# EAGLE design Power (EAGLE 8.3.2)
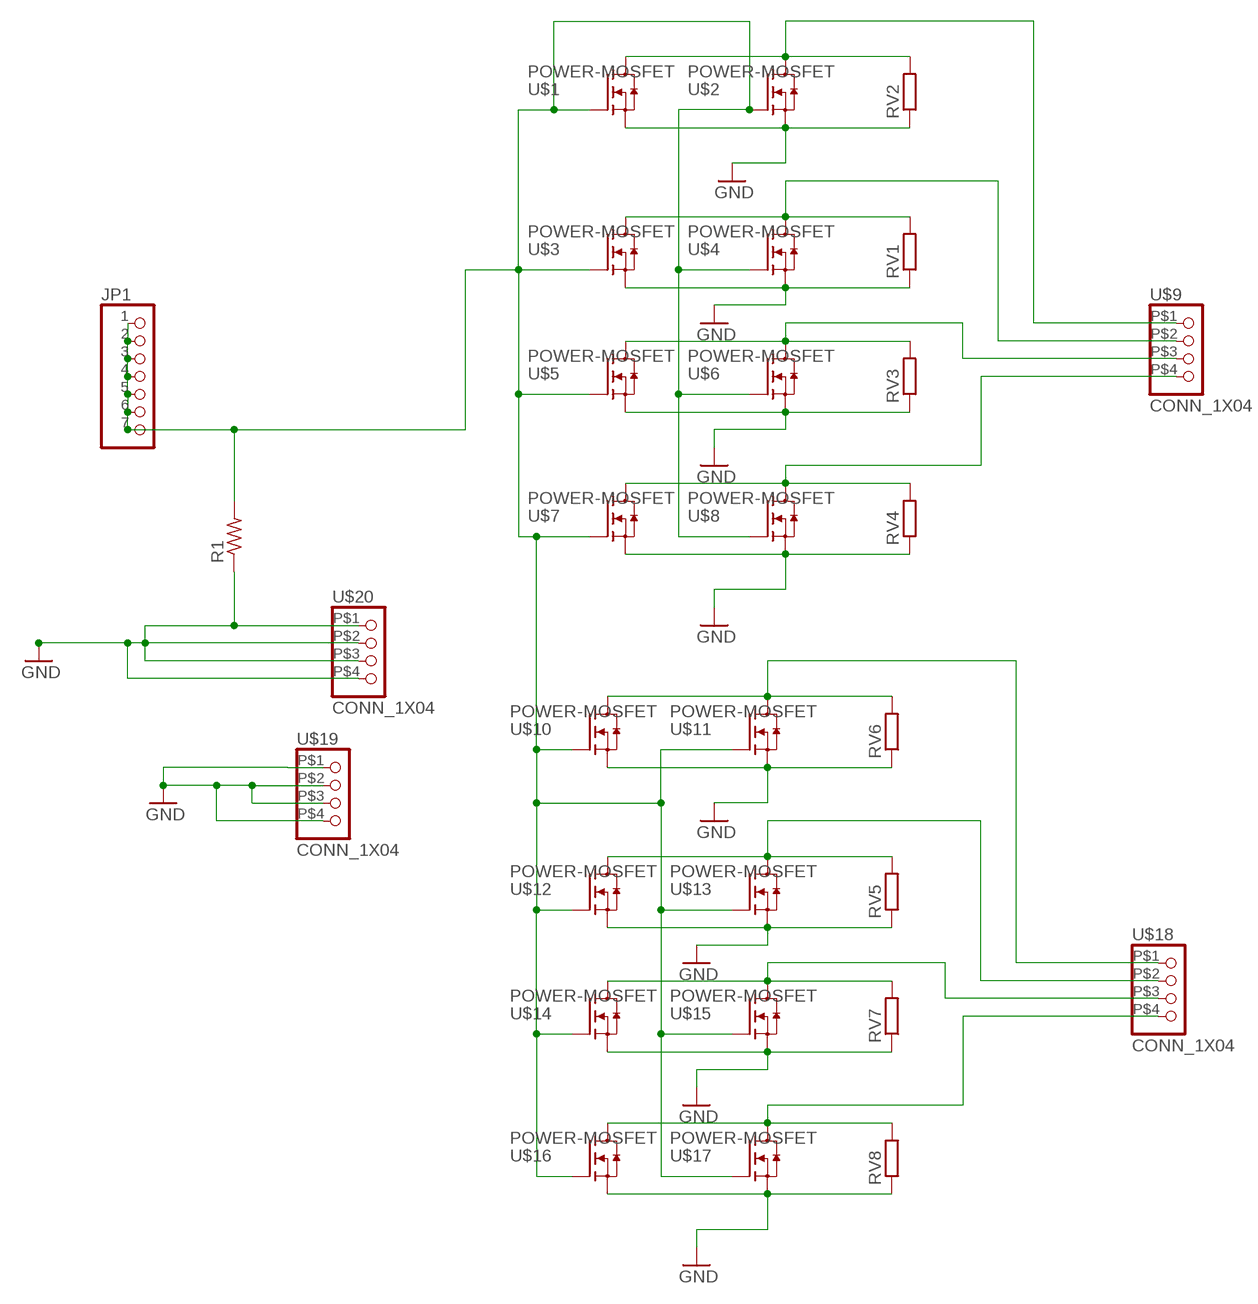
[diagram p0: schematic, sheet 1]

## Parts
JP1  PINHD-1X7  [1X07]
R1  R-US_R0603  [R0603]
RV1  R-EU_R1210  [R1210]
RV2  R-EU_R1210  [R1210]
RV3  R-EU_R1210  [R1210]
RV4  R-EU_R1210  [R1210]
RV5  R-EU_R1210  [R1210]
RV6  R-EU_R1210  [R1210]
RV7  R-EU_R1210  [R1210]
RV8  R-EU_R1210  [R1210]
U$1  POWER-MOSFET  [BSC010N04LS]
U$2  POWER-MOSFET  [BSC010N04LS]
U$3  POWER-MOSFET  [BSC010N04LS]
U$4  POWER-MOSFET  [BSC010N04LS]
U$5  POWER-MOSFET  [BSC010N04LS]
U$6  POWER-MOSFET  [BSC010N04LS]
U$7  POWER-MOSFET  [BSC010N04LS]
U$8  POWER-MOSFET  [BSC010N04LS]
U$9  CONN_1X04  [CONN_1X04]
U$10  POWER-MOSFET  [BSC010N04LS]
U$11  POWER-MOSFET  [BSC010N04LS]
U$12  POWER-MOSFET  [BSC010N04LS]
U$13  POWER-MOSFET  [BSC010N04LS]
U$14  POWER-MOSFET  [BSC010N04LS]
U$15  POWER-MOSFET  [BSC010N04LS]
U$16  POWER-MOSFET  [BSC010N04LS]
U$17  POWER-MOSFET  [BSC010N04LS]
U$18  CONN_1X04  [CONN_1X04]
U$19  CONN_1X04  [CONN_1X04]
U$20  CONN_1X04  [CONN_1X04]

## Nets
GND: R1.1 RV1.1 RV2.1 RV3.1 RV4.1 RV5.1 RV6.1 RV7.1 RV8.1 U$1.P$3(S) U$1.S U$2.P$3(S) U$2.S U$3.P$3(S) U$3.S U$4.P$3(S) U$4.S U$5.P$3(S) U$5.S U$6.P$3(S) U$6.S U$7.P$3(S) U$7.S U$8.P$3(S) U$8.S U$10.P$3(S) U$10.S U$11.P$3(S) U$11.S U$12.P$3(S) U$12.S U$13.P$3(S) U$13.S U$14.P$3(S) U$14.S U$15.P$3(S) U$15.S U$16.P$3(S) U$16.S U$17.P$3(S) U$17.S U$19.P$1 U$19.P$2 U$19.P$3 U$19.P$4 U$20.P$1 U$20.P$2 U$20.P$3 U$20.P$4
N$1: RV2.2 U$1.D U$1.P$1(D) U$1.P$2(D) U$1.P$4(D) U$1.P$5(D) U$1.P$6(D) U$1.P$7(D) U$2.D U$2.P$1(D) U$2.P$2(D) U$2.P$4(D) U$2.P$5(D) U$2.P$6(D) U$2.P$7(D) U$9.P$1
N$2: RV6.2 U$10.D U$10.P$1(D) U$10.P$2(D) U$10.P$4(D) U$10.P$5(D) U$10.P$6(D) U$10.P$7(D) U$11.D U$11.P$1(D) U$11.P$2(D) U$11.P$4(D) U$11.P$5(D) U$11.P$6(D) U$11.P$7(D) U$18.P$1
N$3: RV5.2 U$12.D U$12.P$1(D) U$12.P$2(D) U$12.P$4(D) U$12.P$5(D) U$12.P$6(D) U$12.P$7(D) U$13.D U$13.P$1(D) U$13.P$2(D) U$13.P$4(D) U$13.P$5(D) U$13.P$6(D) U$13.P$7(D) U$18.P$2
N$4: RV7.2 U$14.D U$14.P$1(D) U$14.P$2(D) U$14.P$4(D) U$14.P$5(D) U$14.P$6(D) U$14.P$7(D) U$15.D U$15.P$1(D) U$15.P$2(D) U$15.P$4(D) U$15.P$5(D) U$15.P$6(D) U$15.P$7(D) U$18.P$3
N$5: RV1.2 U$3.D U$3.P$1(D) U$3.P$2(D) U$3.P$4(D) U$3.P$5(D) U$3.P$6(D) U$3.P$7(D) U$4.D U$4.P$1(D) U$4.P$2(D) U$4.P$4(D) U$4.P$5(D) U$4.P$6(D) U$4.P$7(D) U$9.P$2
N$6: RV3.2 U$5.D U$5.P$1(D) U$5.P$2(D) U$5.P$4(D) U$5.P$5(D) U$5.P$6(D) U$5.P$7(D) U$6.D U$6.P$1(D) U$6.P$2(D) U$6.P$4(D) U$6.P$5(D) U$6.P$6(D) U$6.P$7(D) U$9.P$3
N$7: RV8.2 U$16.D U$16.P$1(D) U$16.P$2(D) U$16.P$4(D) U$16.P$5(D) U$16.P$6(D) U$16.P$7(D) U$17.D U$17.P$1(D) U$17.P$2(D) U$17.P$4(D) U$17.P$5(D) U$17.P$6(D) U$17.P$7(D) U$18.P$4
N$8: RV4.2 U$7.D U$7.P$1(D) U$7.P$2(D) U$7.P$4(D) U$7.P$5(D) U$7.P$6(D) U$7.P$7(D) U$8.D U$8.P$1(D) U$8.P$2(D) U$8.P$4(D) U$8.P$5(D) U$8.P$6(D) U$8.P$7(D) U$9.P$4
N$9: JP1.1 JP1.2 JP1.3 JP1.4 JP1.5 JP1.6 JP1.7 R1.2 U$1.G U$2.G U$3.G U$4.G U$5.G U$6.G U$7.G U$8.G U$10.G U$11.G U$12.G U$13.G U$14.G U$15.G U$16.G U$17.G

## Library data of the parts
JP1 = pinhead:PINHD-1X7: PIN HEADER
R1 = resistor:R-US_: RESISTOR, American symbol
RV1-RV8 = resistor:R-EU_: RESISTOR, European symbol
U$1-U$8 U$10-U$17 = Power-MOSFET:POWER-MOSFET
U$9 U$18-U$20 = Motor_Connector:CONN_1X04

## Board
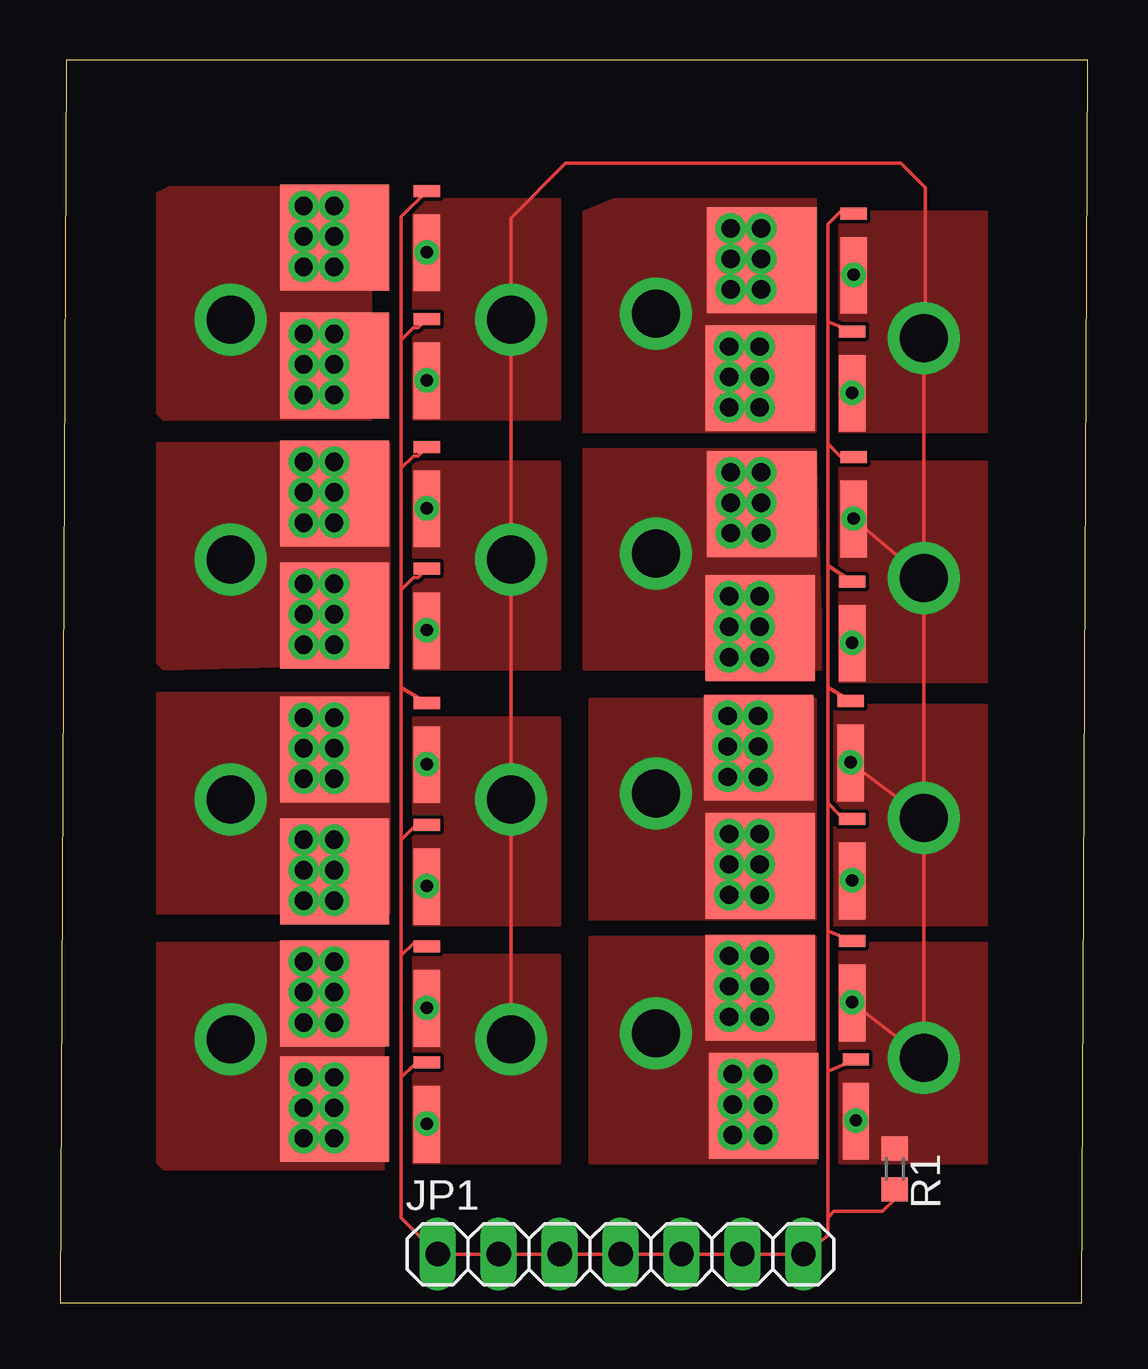
[diagram p1: board, top side]
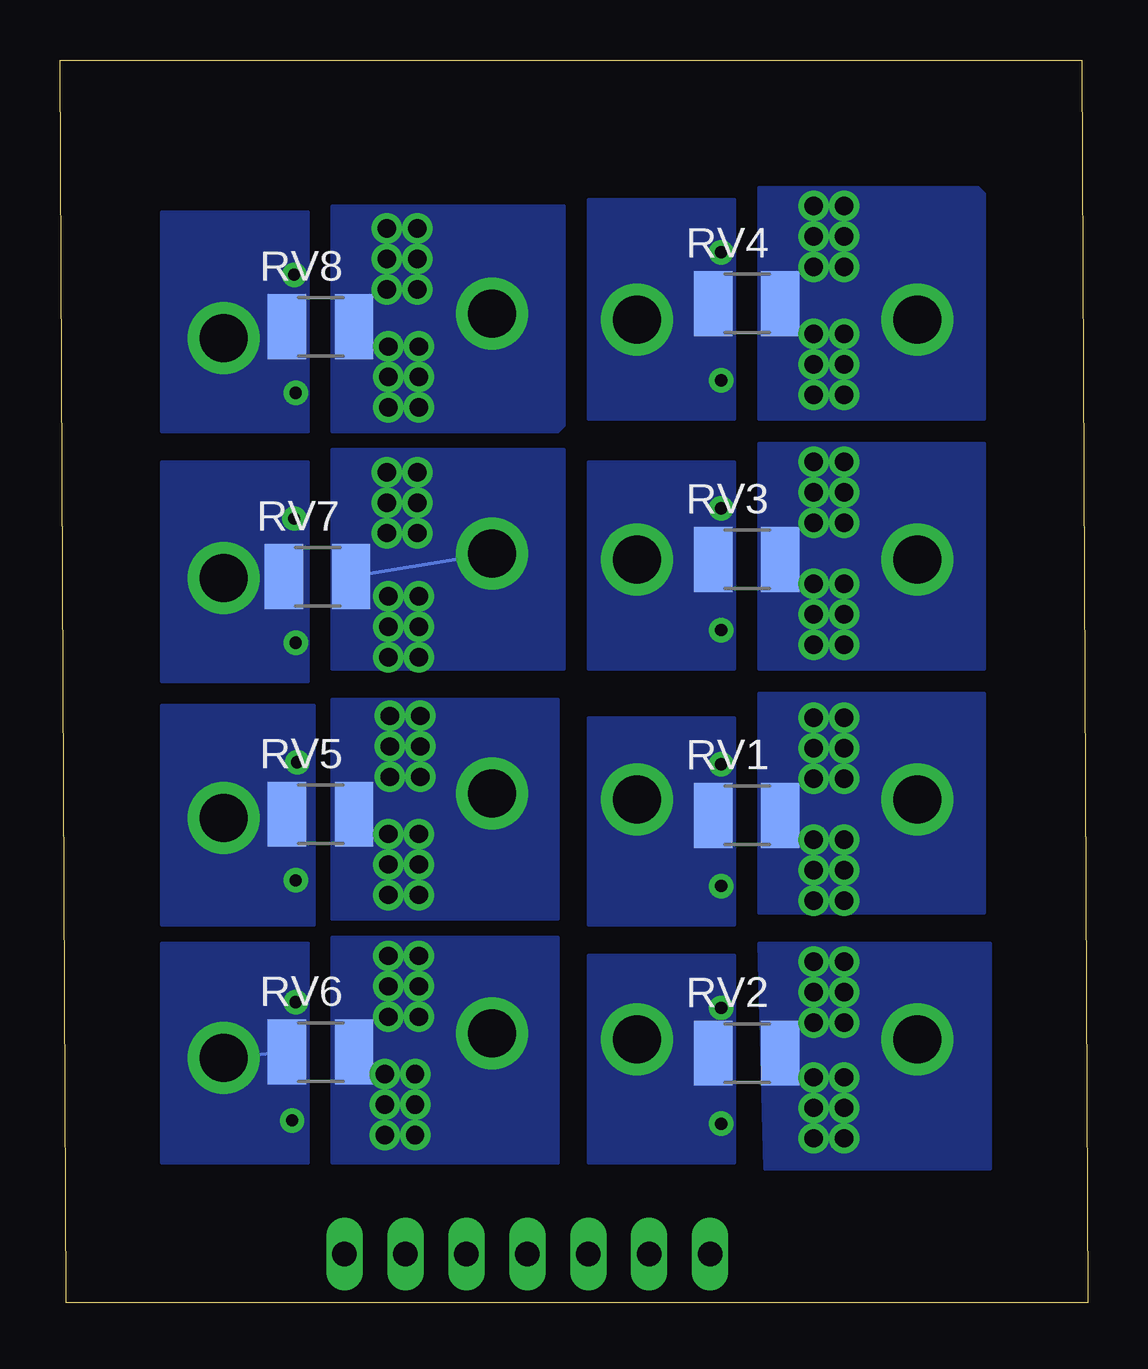
[diagram p2: board, bottom side, seen from below]

Size 42.85 x 51.81 mm. Coordinates in mm from the lower left corner, seen from the top.
Outline: 0,0 42.6,0 42.85,51.81 0.25,51.81 0,0
Copper layers (1*16): Top 0.035mm / dielectric 1.5mm / Bottom 0.035mm
Design rules "default *": minimum track width 6mil, minimum drill 0.35mm, track to track 6mil, track to pad 6mil, pad to pad 6mil, via to via 6mil, smd to smd 6mil, copper to edge 40mil, drill to drill 6mil, minimum pad ring 10mil, minimum via ring 8mil, stop-mask expansion 4mil, vias tented up to drill 30mil, thermal gap 10mil

### Footprints (pad centres in the part's own frame; a part is rotated, then mirrored left to right if it is on the bottom)
1X07 = drill 1.016 long: 1 -7.62,0; 2 -5.08,0; 3 -2.54,0; 4 0,0; 5 2.54,0; 6 5.08,0; 7 7.62,0
R0603 = smd 1 x 1.1: 1 -0.85,0; 2 0.85,0
R1210 = smd 1.6 x 2.7: 1 -1.4,0; 2 1.4,0
BSC010N04LS = smd 4.41 x 4.55: D 0.2,3.28 | smd 0.5 x 1.1: G 2.15,-0.56 | drill 0.762: P$1 1.524,4.572; P$2 -1.016,3.302; P$4 0.254,4.572; P$5 -1.016,4.572; P$6 0.254,3.302; P$7 1.524,3.302 | drill 0.508: P$3 -0.406,-0.559 | smd 3.2 x 1.1: S -0.43,-0.56
CONN_1X04 = drill 2 pad 2.5: P$1 -20,0; P$2 -10,0; P$3 0,0; P$4 10,0

### Placement (x,y rotation side)
JP1  23.37,2.03 0 top
R1  34.8,5.59 270 top
RV1  14.22,20.32 0 bottom
RV2  14.22,10.41 0 bottom
RV3  14.22,30.99 0 bottom
RV4  14.22,41.66 0 bottom
RV5  31.99,20.37 0 bottom
RV6  31.99,10.46 0 bottom
RV7  32.12,30.27 0 bottom
RV8  31.99,40.69 0 bottom
U$1  14.73,12.7 90 top
U$2  14.73,7.87 90 top
U$3  14.73,22.86 90 top
U$4  14.73,17.78 90 top
U$5  14.73,28.45 90 top
U$6  14.73,33.53 90 top
U$7  14.73,38.86 90 top
U$8  14.73,44.2 90 top
U$9  7.11,30.99 90 top
U$10  32.46,12.94 90 top
U$11  32.62,8.01 90 top
U$12  32.4,22.94 90 top
U$13  32.46,18.02 90 top
U$14  32.53,33.1 90 top
U$15  32.46,27.92 90 top
U$16  32.53,43.26 90 top
U$17  32.46,38.34 90 top
U$18  24.84,31.23 90 top
U$19  18.8,30.99 90 top
U$20  36.02,30.21 90 top

### Tracks (layer width: path | path; a pad name or v marks a point on that pad's centre or on a via)
GND
  Top 0.152: 35.55,20.56 U$20.P$2 U$20.P$3 | 35.55,20.56 U$12.S | U$14.S U$20.P$3 | 35.55,20.56 36.02,20.09 U$20.P$1 U$10.S | U$20.P$3 U$20.P$4 36.07,40.26 36.07,46.48 35.05,47.5 21.08,47.5 18.8,45.21 U$19.P$4 U$19.P$3 U$19.P$2 U$19.P$1
  Bottom 0.152: U$20.P$1 RV6.1
  pour Top (no thermals): 20.83,5.84 20.83,14.48 14.73,14.48 14.73,5.84
  pour Bottom (no thermals): 14.73,5.84 14.73,14.48 20.83,14.48 20.83,5.84
  pour Top (no thermals): 20.83,15.75 20.83,24.38 14.73,24.38 14.73,15.75
  pour Bottom (no thermals): 14.73,15.75 14.73,24.38 20.83,24.38 20.83,15.75
  pour Top (no thermals): 20.83,26.42 20.83,35.05 14.73,35.05 14.73,26.42
  pour Bottom (no thermals): 14.73,26.42 14.73,35.05 20.83,35.05 20.83,26.42
  pour Top (no thermals): 20.83,36.83 20.83,45.97 14.73,45.97 14.73,36.83
  pour Bottom (no thermals): 14.73,36.83 14.73,45.97 20.83,45.97 20.83,36.83
  pour Top (no thermals): 38.61,36.32 38.61,45.47 32.51,45.47 32.51,36.32
  pour Bottom (no thermals): 32.51,36.32 32.51,45.47 38.61,45.47 38.61,36.32
  pour Top (no thermals): 38.61,25.91 38.61,35.05 32.51,35.05 32.51,25.91
  pour Bottom (no thermals): 32.51,25.91 32.51,35.05 38.61,35.05 38.61,25.91
  pour Top (no thermals): 38.61,15.75 38.61,24.89 32.26,24.89 32.26,15.75
  pour Bottom (no thermals): 32.26,15.75 32.26,24.89 38.61,24.89 38.61,15.75
  pour Bottom (no thermals): 32.51,5.84 32.51,14.99 38.61,14.99 38.61,5.84
  pour Top (no thermals): 38.61,5.84 38.61,14.99 32.51,14.99 32.51,5.84
N$1
  pour Top (no thermals): 4.06,14.99 4.06,5.84 4.32,5.59 13.46,5.59 13.46,14.99
  pour Bottom (rank 2, no thermals): 13.46,5.59 13.72,14.99 4.06,14.99 4.06,5.59
N$2
  pour Top (no thermals): 22.1,15.24 22.1,5.84 31.5,5.84 31.5,15.24
  pour Bottom (no thermals): 31.5,5.84 31.5,15.24 22.1,15.24 22.1,5.84
N$3
  pour Top (no thermals): 22.1,25.15 22.1,16 31.5,16 31.5,25.15
  pour Bottom (no thermals): 31.5,16 31.5,25.15 22.1,25.15 22.1,16
N$4
  Bottom 0.152: U$18.P$3 RV7.2
  pour Top (no thermals): 21.84,35.56 21.84,26.42 31.75,26.42 31.5,35.56
  pour Bottom (no thermals): 31.5,35.56 21.84,35.56 21.84,26.42 31.5,26.42
N$5
  pour Top (no thermals): 4.06,25.4 4.06,16.26 13.72,16.26 13.72,25.4
  pour Bottom (no thermals): 13.72,16.26 13.72,25.4 4.32,25.4 4.32,16.26
N$6
  pour Top (no thermals): 4.06,35.81 4.06,26.67 4.32,26.42 13.72,26.67 13.72,35.81
  pour Bottom (no thermals): 13.72,26.42 13.72,35.81 4.32,35.81 4.32,26.42
N$7
  pour Top (no thermals): 21.84,45.47 21.84,36.32 31.5,36.32 31.5,45.97 23.11,45.97
  pour Bottom (no thermals): 31.5,45.72 21.84,45.72 21.84,36.58 22.1,36.32 31.5,36.32
N$8
  pour Top (no thermals): 4.06,46.23 4.06,37.08 4.32,36.83 12.95,36.83 12.95,46.48 4.57,46.48
  pour Bottom (no thermals): 13.72,36.83 13.72,46.48 4.57,46.48 4.32,46.23 4.32,36.83
N$9
  Top 0.152: 14.22,9.4 14.22,3.56 JP1.1 JP1.2 | 14.22,9.4 14.22,14.48 | 14.22,14.48 14.22,19.3 | 14.22,25.65 14.22,19.3 | 14.22,25.65 14.22,29.72 | 14.22,29.72 14.22,34.8 | 14.22,34.8 14.22,40.13 | 14.22,40.13 14.22,45.28 U$8.G | 14.22,40.13 14.73,40.64 14.92,40.64 U$7.G | 14.22,34.8 14.73,35.31 14.92,35.31 U$6.G | 14.22,29.72 14.73,30.23 14.92,30.23 U$5.G | 14.22,19.3 14.73,19.81 15.17,19.81 U$4.G | 14.22,14.48 14.73,14.99 15.16,14.99 U$1.G | 14.22,9.4 14.73,9.91 15.17,9.91 U$2.G | JP1.7 32,2.79 32,3.56 | U$16.G 33.03,45.47 32.51,45.47 32,44.96 32,40.89 | 32,9.65 32,3.56 | 32,9.65 32,15.49 | 32,25.65 32,30.73 | 32,30.73 32,35.81 | 32,40.89 32,35.81 | 32,35.81 32.51,35.31 33.03,35.31 U$14.G | 32,25.65 U$12.G | 32,15.49 U$10.G | 32,30.73 U$15.G | U$17.G 32,40.89 | R1.2 34.8,4.32 34.29,3.81 32.26,3.81 32,3.56 | 32,15.49 32,20.83 | 32,20.83 32,25.65 | 32,20.83 32.51,20.32 32.87,20.32 U$13.G | JP1.4 JP1.5 JP1.7 | JP1.4 JP1.2 | JP1.2 JP1.3 JP1.4 | U$11.G 32,9.65 | JP1.6 JP1.7 | U$3.G 14.22,25.65